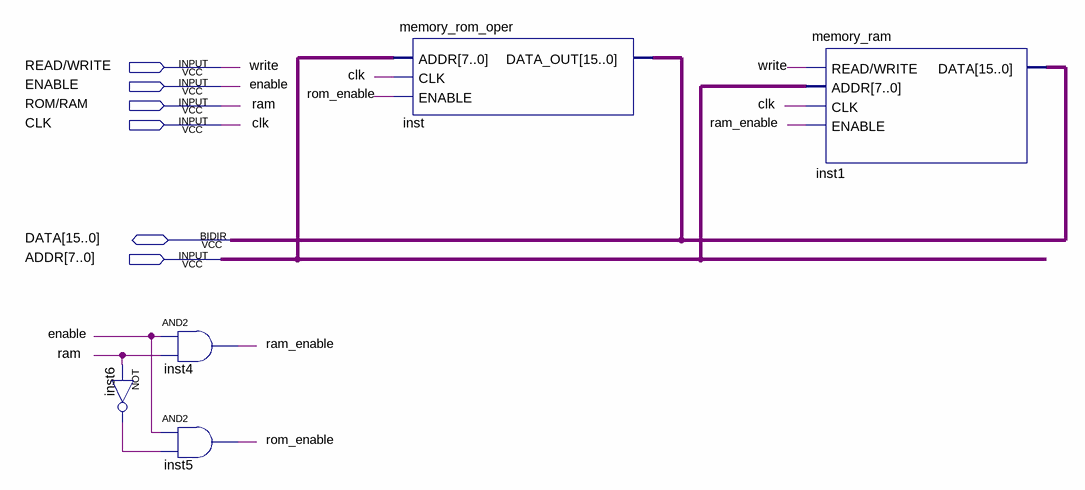
[diagram p0: schematic sheet]
// Quartus schematic memory_block.bdf as structural Verilog: 5 symbols, 6 pins
module memory_block (
  input  \READ/WRITE ,
  input  ENABLE,
  input  \ROM/RAM ,
  input  CLK,
  input  [7:0] ADDR,
  inout  [15:0] DATA
);

  wire inst6_out, ram_enable, rom_enable;

  and inst4 (ram_enable, ENABLE, \ROM/RAM );
  not inst6 (inst6_out, \ROM/RAM );
  and inst5 (rom_enable, ENABLE, inst6_out);
  memory_rom_oper inst (.ADDR(ADDR), .CLK(CLK), .ENABLE(rom_enable), .DATA_OUT(DATA));
  memory_ram inst1 (.\READ/WRITE (\READ/WRITE ), .ADDR(ADDR), .CLK(CLK), .ENABLE(ram_enable), .DATA(DATA));

  // Other names for the same wires on the sheet: ram = \ROM/RAM ; write = \READ/WRITE 
endmodule
